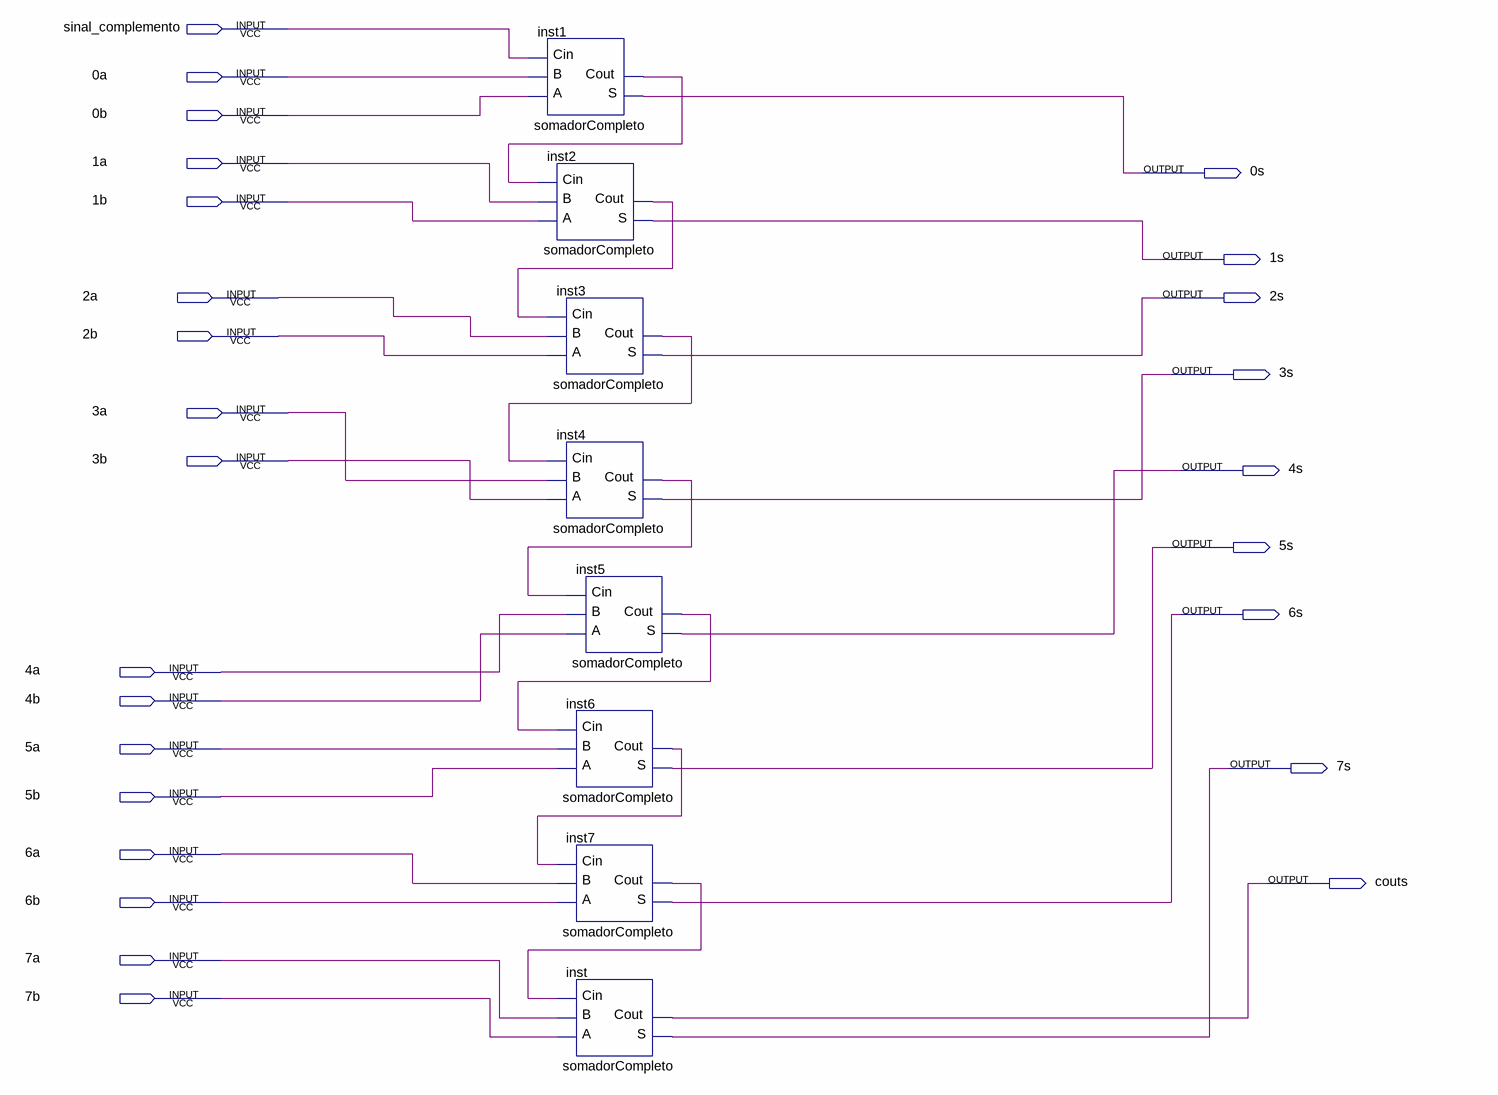
[diagram p0: schematic sheet]
// Quartus schematic somador4BitsDobrado.bdf as structural Verilog: 8 symbols, 26 pins
module somador4BitsDobrado (
  input  sinal_complemento,
  input  \0a ,
  input  \0b ,
  input  \1a ,
  input  \1b ,
  input  \2a ,
  input  \2b ,
  input  \3a ,
  input  \3b ,
  input  \4a ,
  input  \4b ,
  input  \5a ,
  input  \5b ,
  input  \6a ,
  input  \6b ,
  input  \7a ,
  input  \7b ,
  output \0s ,
  output \1s ,
  output \2s ,
  output \3s ,
  output \4s ,
  output \5s ,
  output \6s ,
  output \7s ,
  output couts
);

  wire inst1_cout, inst2_cout, inst3_cout, inst4_cout, inst5_cout, inst6_cout, inst7_cout;

  somadorCompleto inst1 (.A(\0b ), .B(\0a ), .Cin(sinal_complemento), .S(\0s ), .Cout(inst1_cout));
  somadorCompleto inst2 (.A(\1b ), .B(\1a ), .Cin(inst1_cout), .S(\1s ), .Cout(inst2_cout));
  somadorCompleto inst3 (.A(\2b ), .B(\2a ), .Cin(inst2_cout), .S(\2s ), .Cout(inst3_cout));
  somadorCompleto inst4 (.A(\3b ), .B(\3a ), .Cin(inst3_cout), .S(\3s ), .Cout(inst4_cout));
  somadorCompleto inst5 (.A(\4b ), .B(\4a ), .Cin(inst4_cout), .S(\4s ), .Cout(inst5_cout));
  somadorCompleto inst6 (.A(\5b ), .B(\5a ), .Cin(inst5_cout), .S(\5s ), .Cout(inst6_cout));
  somadorCompleto inst7 (.A(\6b ), .B(\6a ), .Cin(inst6_cout), .S(\6s ), .Cout(inst7_cout));
  somadorCompleto inst (.A(\7b ), .B(\7a ), .Cin(inst7_cout), .S(\7s ), .Cout(couts));
endmodule
